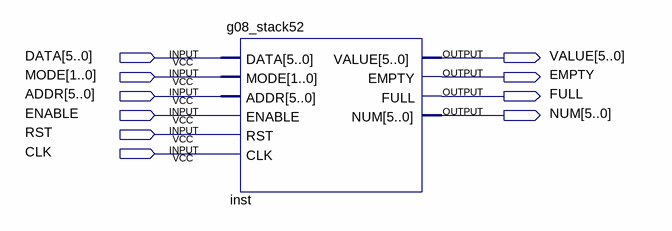
[diagram p0: schematic sheet]
// Quartus schematic g08_lab3.bdf as structural Verilog: 1 symbols, 10 pins
module g08_lab3 (
  input  [5:0] DATA,
  input  [1:0] MODE,
  input  [5:0] ADDR,
  input  ENABLE,
  input  RST,
  input  CLK,
  output [5:0] VALUE,
  output EMPTY,
  output FULL,
  output [5:0] NUM
);

  g08_stack52 inst (
    .DATA(DATA), .MODE(MODE), .ADDR(ADDR), .ENABLE(ENABLE), .RST(RST), .CLK(CLK), .VALUE(VALUE),
    .EMPTY(EMPTY), .FULL(FULL), .NUM(NUM));
endmodule
